# EAGLE schematic rc360detector (EAGLE 7.4.0)
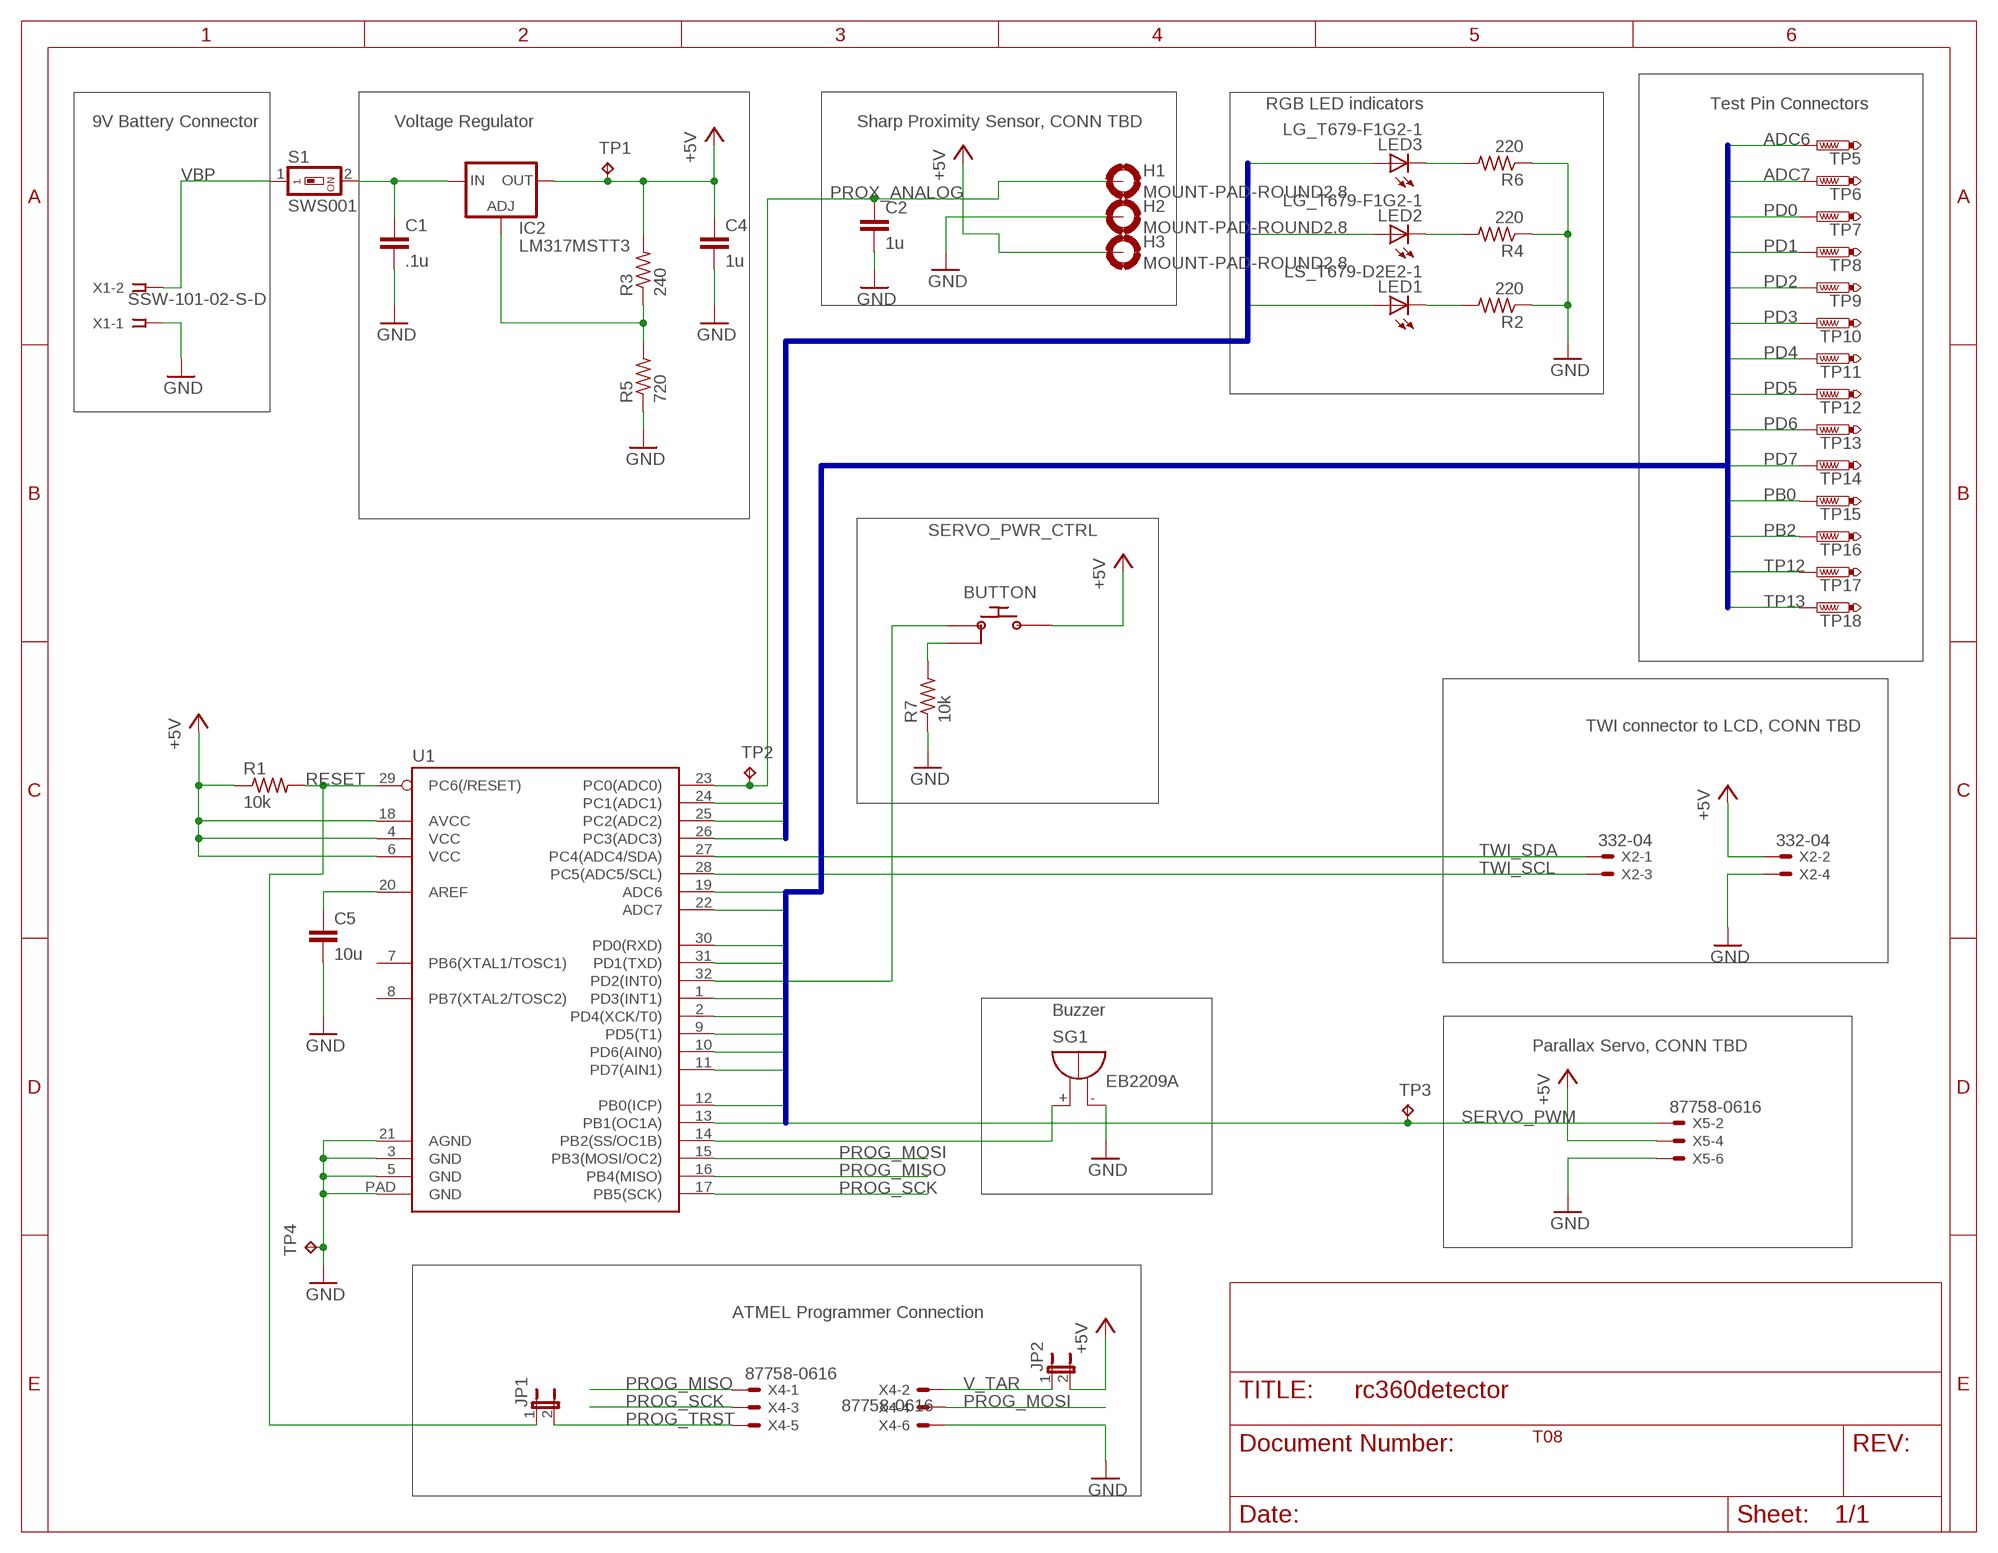
[diagram p0: schematic, sheet 1]

## Parts
BUTTON  PR141C  [3_THROUGH_HOLE]
C1  .1u  C-EUC0603  [C0603]
C2  1u  C-EUC0805  [C0805]
C4  1u  C-EUC0603  [C0603]
C5  10u  C-EUC0603  [C0603]
H1  MOUNT-PAD-ROUND2.8  [2,8-PAD]
H2  MOUNT-PAD-ROUND2.8  [2,8-PAD]
H3  MOUNT-PAD-ROUND2.8  [2,8-PAD]
IC2  LM317MSTT3  [SOT223]
JP1  JP1E  [JP1]
JP2  JP1E  [JP1]
LED1  LS_T679-D2E2-1  [PLCC2]
LED2  LG_T679-F1G2-1  [PLCC2]
LED3  LG_T679-F1G2-1  [PLCC2]
R1  10k  R-US_R0603  [R0603]
R2  220  R-US_R0805  [R0805]
R3  240  R-US_R0603  [R0603]
R4  220  R-US_R0805  [R0805]
R5  720  R-US_R0603  [R0603]
R6  220  R-US_R0805  [R0805]
R7  10k  R-US_R0805  [R0805]
S1  SWS001  [SMS-001]
SG1  EB2209A  [EB2209A]
TP1  TPPAD1-17  [P1-17]
TP2  TPPAD1-17  [P1-17]
TP3  TPPAD1-17  [P1-17]
TP4  TPPAD1-17  [P1-17]
TP5  PTR1PAD1-20  [P1-20]
TP6  PTR1PAD1-20  [P1-20]
TP7  PTR1PAD1-20  [P1-20]
TP8  PTR1PAD1-20  [P1-20]
TP9  PTR1PAD1-20  [P1-20]
TP10  PTR1PAD1-20  [P1-20]
TP11  PTR1PAD1-20  [P1-20]
TP12  PTR1PAD1-20  [P1-20]
TP13  PTR1PAD1-20  [P1-20]
TP14  PTR1PAD1-20  [P1-20]
TP15  PTR1PAD1-20  [P1-20]
TP16  PTR1PAD1-20  [P1-20]
TP17  PTR1PAD1-20  [P1-20]
TP18  PTR1PAD1-20  [P1-20]
U1  ATMEGA328P_MLFMLF32  [MLF32-PAD]
X1  SSW-101-02-S-D  [SSW-101-02-S-D]
X2  332-04  [332-04]
X4  87758-0616  [87758-0616]
X5  87758-0616  [87758-0616]

## Nets
+5V: BUTTON.P$3(OUT) C4.1 H3.B2,8(MOUNT) IC2.4(OUT) JP2.2 R1.1 R3.2 TP1.TP U1.4(VCC) U1.6(VCC) U1.18(AVCC) X2.2 X5.4
ADC6: TP5.TP U1.19(ADC6)
ADC7: TP6.TP
AREF: C5.1 U1.20(AREF)
GND: C1.2 C2.2 C4.2 C5.2 H2.B2,8(MOUNT) R2.1 R4.1 R5.1 R6.1 R7.1 SG1.- TP4.TP U1.3(GND) U1.5(GND) U1.21(AGND) U1.PAD(GND) X1.1 X2.4 X4.6 X5.6
LED0: LED1.A U1.24(PC1(ADC1))
LED1: LED2.A U1.25(PC2(ADC2))
LED2: LED3.A U1.26(PC3(ADC3))
N$1: BUTTON.P$2(GND) R7.2
N$2: IC2.1(ADJ) R3.1 R5.2
N$3: BUTTON.P$1(IN) U1.32(PD2(INT0))
N$4: SG1.+ U1.14(PB2(SS/OC1B))
N$5: LED3.C R6.2
N$6: C1.1 IC2.3(IN) S1.2
N$7: LED2.C R4.2
N$8: LED1.C R2.2
PB0: TP15.TP
PB2: TP16.TP
PD0: TP7.TP
PD1: TP8.TP
PD2: TP9.TP
PD3: TP10.TP
PD4: TP11.TP
PD5: TP12.TP
PD6: TP13.TP
PD7: TP14.TP
PROG_MISO: U1.16(PB4(MISO)) X4.1
PROG_MOSI: U1.15(PB3(MOSI/OC2)) X4.4
PROG_SCK: U1.17(PB5(SCK)) X4.3
PROG_TRST: JP1.2 X4.5
PROX_ANALOG: C2.1 H1.B2,8(MOUNT) TP2.TP U1.23(PC0(ADC0))
RESET: JP1.1 R1.2 U1.29(PC6(/RESET))
SERVO_PWM: TP3.TP U1.13(PB1(OC1A)) X5.2
TP1: U1.22(ADC7)
TP2: U1.30(PD0(RXD))
TP3: U1.31(PD1(TXD))
TP5: U1.1(PD3(INT1))
TP6: U1.2(PD4(XCK/T0))
TP7: U1.9(PD5(T1))
TP8: U1.10(PD6(AIN0))
TP9: U1.11(PD7(AIN1))
TP10: U1.12(PB0(ICP))
TP12: TP17.TP
TP13: TP18.TP
TWI_SCL: U1.28(PC5(ADC5/SCL)) X2.3
TWI_SDA: U1.27(PC4(ADC4/SDA)) X2.1
V_TAR: JP2.1 X4.2
VBP: S1.1 X1.2
Unconnected: U1.7(PB6(XTAL1/TOSC1)) U1.8(PB7(XTAL2/TOSC2)) X5.1 X5.3 X5.5

## Buses
LED[0..2]
TP[0..14]

## Notes on the sheet
- RGB LED indicators | Test Pin Connectors
- 9V Battery Connector | Voltage Regulator | Sharp Proximity Sensor, CONN TBD
- SERVO_PWR_CTRL
- TWI connector to LCD, CONN TBD
- Buzzer
- Parallax Servo, CONN TBD
- ATMEL Programmer Connection
- T08

## Library data of the parts
BUTTON = 360prox:PR141C
C1 C2 C4 C5 = rcl:C-EU: CAPACITOR, European symbol
H1-H3 = holes:MOUNT-PAD-ROUND: MOUNTING PAD, round
IC2 = v-reg:LM317?*: 500 mA Adjustable Output Positive Voltage Regulator Source: http://www.onsemi.co.jp .. LM317M-D.PDF
JP1 JP2 = jumper:JP1E: JUMPER
LED1 = led:*_T679-?-1: LC TOPLED® Low Current LED Source: http://catalog.osram-os.com .. LG_LS_LY_T679_OBS.pdf; COLOR: super-red
LED2 LED3 = led:*_T679-?-1: LC TOPLED® Low Current LED Source: http://catalog.osram-os.com .. LG_LS_LY_T679_OBS.pdf; COLOR: green
R1-R7 = rcl:R-US_: RESISTOR, American symbol
S1 = smd-special:SWS001: SMD Dip Switch 1 pol.
SG1 = buzzer:EB2209A: BUZZER Source: Buerklin; OC_FARNELL: unknown; OC_NEWARK: unknown
TP1-TP4 = testpad:TP: Test pad
TP5-TP18 = testpad:PTR1: TEST PIN
U1 = SparkFun-DigitalIC:ATMEGA328P_MLF: 32-Pin Atmega328 part Commonly used on Arduino compatible boards Available in QFP and QFN packages TQFP is IC-09069 QFN is non-stock
X1 = con-samtec:SSW-101-02-S-D: THROUGH-HOLE .025" SQ POST SOCKET Source: Samtec SSW.pdf; MPN: SSW-101-02-S-D; OC_FARNELL: unknown; OC_NEWARK: 82P1456
X2 = con-garry:332-04: 4 Pin - 2mm Dual Row Source: www.mpe-connector.de / garry_shortform_2012.pdf
X4 X5 = con-molex:87758-0616: 6 Pin - 2mm Dual Row Single Wafer, Vertical T/H HDR Source: http://www.molex.com/pdm_docs/sd/877580616_sd.pdf; MPN: 87758-0616; OC_FARNELL: 7472323; OC_NEWARK: 25M5667